# Altium schematic sheet seeds.SchDoc
size A4
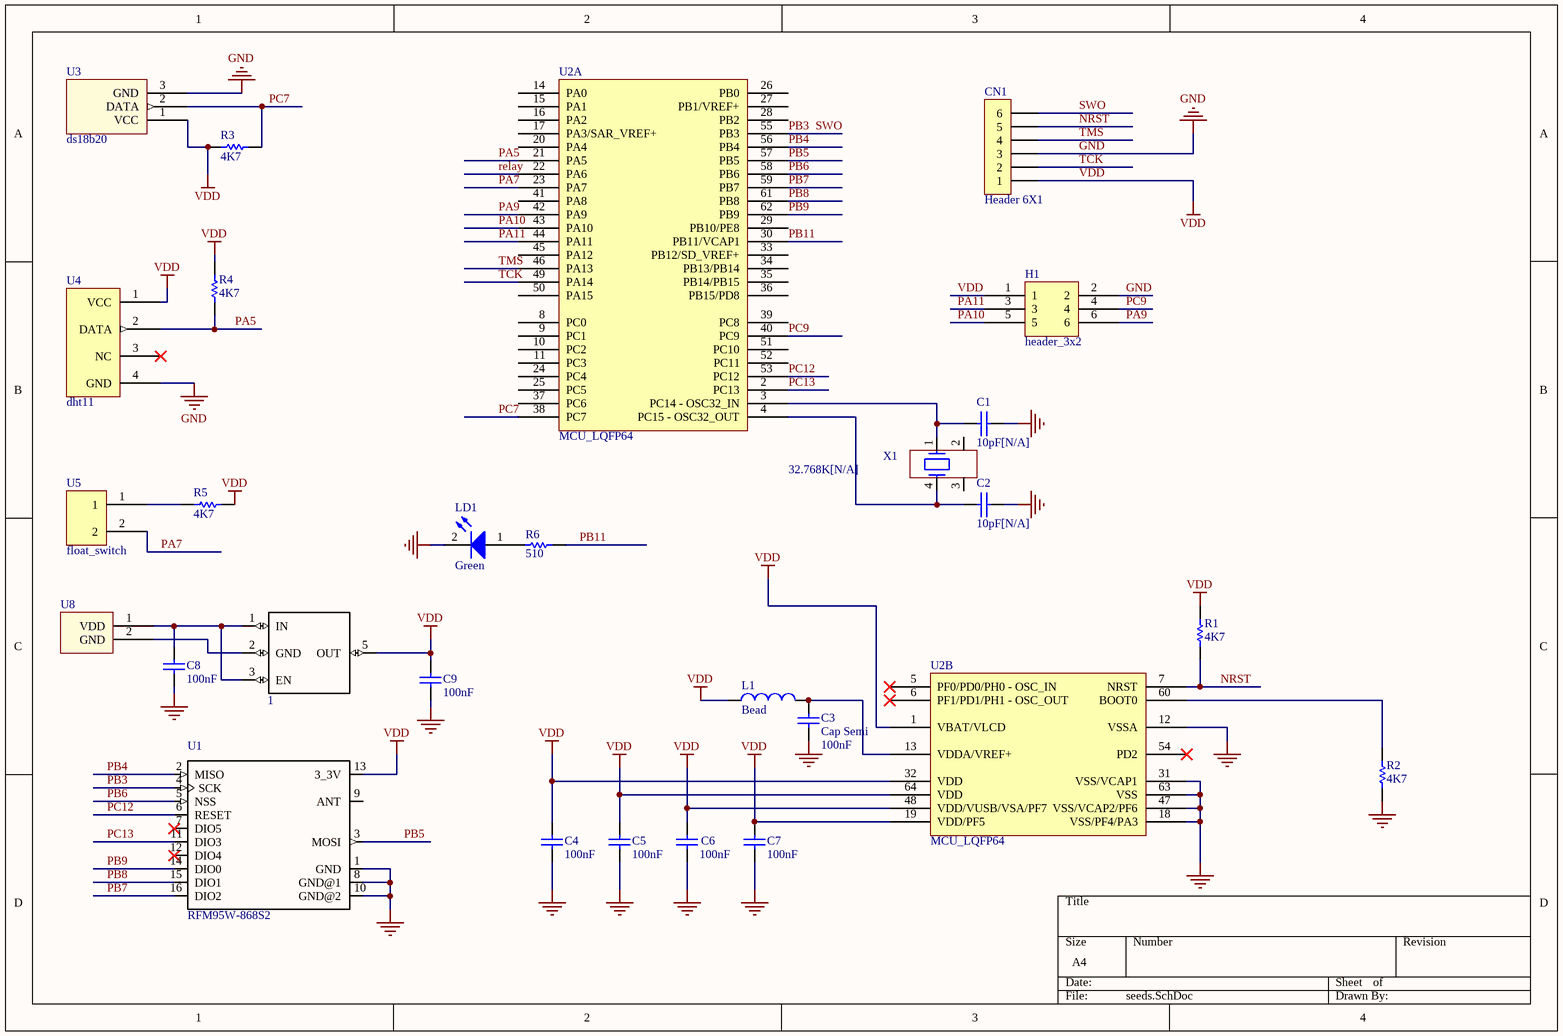
[diagram p0: seeds.SchDoc]

## Parts
1  TLV70233DBVR  [SOT23-5]  (value not drawn)
C1  10pF[N/A]  [0603C]
C2  10pF[N/A]  [0603C]
C3  Cap Semi  value 100nF  [1608[0603]]
C4  100nF  [0603C]
C5  100nF  [0603C]
C6  100nF  [0603C]
C7  100nF  [0603C]
C8  100nF  [0603C]
C9  100nF  [0603C]
CN1  Header 6X1  [1*6P]
H1  header_3x2  [header_3x2]
L1  Bead  [INDC1608L]
LD1  Green  [0603D]
R1  4K7  [0603R]
R2  4K7  [0603R]
R3  4K7  [0603R]
R4  4K7  [0603R]
R5  4K7  [0603R]
R6  510  [0603R]
U1  RFM95W-868S2  [XCVR_RFM95W-868S2]
U2  MCU_LQFP64  [LQFP64]  (parts A,B of 2)
U3  ds18b20  [ds18b20]
U4  dht11  [dht11]
U5  float_switch  [float_switch]
U8  BATTERY_CONNECTOR  [BATTERY_CONNECTOR]  (value not drawn)
X1  32.768K[N/A]  [XTAL_4SM_8X3R8]

## Nets
GND: C1.2 C2.2 C3.2 C4.2 C5.2 C6.2 C7.2 C8.2 C9.2 CN1.3 H1.2 LD1.2(K) R2.1 U1.1(GND) U1.8(GND@1) U1.10(GND@2) U2.12(VSSA) U2.18(VSS/PF4/PA3) U2.31(VSS/VCAP1) U2.47(VSS/VCAP2/PF6) U2.63(VSS) U3.3(GND) U4.4(GND)
VDD: 1.5(OUT) C4.1 C5.1 C6.1 C7.1 C9.1 CN1.1 H1.1 L1.1 R1.2 R3.2 R4.1 R5.1 U1.13(3_3V) U2.1(VBAT/VLCD) U2.19(VDD/PF5) U2.32(VDD) U2.48(VDD/VUSB/VSA/PF7) U2.64(VDD) U3.1(VCC) U4.1(VCC)
NRST: CN1.5 R1.1 U2.7(NRST)
PA5: R4.2 U2.21(PA5) U4.2(DATA)
PA7: U2.23(PA7) U5.2
PA9: H1.6 U2.42(PA9)
PA10: H1.5 U2.43(PA10)
PA11: H1.3 U2.44(PA11)
PB3: CN1.6 U1.4(SCK) U2.55(PB3)  [also labelled SWO]
PB4: U1.2(MISO) U2.56(PB4)
PB5: U1.3(MOSI) U2.57(PB5)
PB6: U1.5(NSS) U2.58(PB6)
PB7: U1.16(DIO2) U2.59(PB7)
PB8: U1.15(DIO1) U2.61(PB8)
PB9: U1.14(DIO0) U2.62(PB9)
PB11: R6.1 U2.30(PB11/VCAP1)
PC7: R3.1 U2.38(PC7) U3.2(DATA)
PC9: H1.4 U2.40(PC9)
PC12: U1.6(RESET) U2.53(PC12)
PC13: U1.11(DIO3) U2.2(PC13)
relay: U2.22(PA6)
TCK: CN1.2 U2.49(PA14)
TMS: CN1.4 U2.46(PA13)
Net1_1: 1.1(IN) 1.3(EN) C8.1 U8.1(VDD)
Net1_2: 1.2(GND) U8.2(GND)
NetC1_1: C1.1 U2.3(PC14_-_OSC32_IN) X1.1
NetC2_1: C2.1 U2.4(PC15_-_OSC32_OUT) X1.4
NetC3_1: C3.1 L1.2 U2.13(VDDA/VREF+)
NetLD1_1: LD1.1(A) R6.2
NetR2_2: R2.2 U2.60(BOOT0)
NetR5_2: R5.2 U5.1

Not connected (* = marked no-connect by the designer): U1 7(DIO5)* 9(ANT) 12(DIO4)*; U2 5(PF0/PD0/PH0_-_OSC_IN)* 6(PF1/PD1/PH1_-_OSC_OUT)* 8(PC0) 9(PC1) 10(PC2) 11(PC3) 14(PA0) 15(PA1) 16(PA2) 17(PA3/SAR_VREF+) 20(PA4) 24(PC4) 25(PC5) 26(PB0) 27(PB1/VREF+) 28(PB2) 29(PB10/PE8) 33(PB12/SD_VREF+) 34(PB13/PB14) 35(PB14/PB15) 36(PB15/PD8) 37(PC6) 39(PC8) 41(PA8) 45(PA12) 50(PA15) 51(PC10) 52(PC11) 54(PD2)*; U4 3(NC)*; X1 2 3

## Library data of the parts
1 = TLV70233DBVR: LDO voltage regulator [Texas Instruments] TLV70233DBVR LDO voltage regulator; MP: TLV70233DBVR; Package: None; MF: Texas Instruments; Price: 0.25 USD; Availability: Good; Value: *
C1 = Cap: Capacitor
C2 = CAP: Capacitor
C3 = Cap Semi: Capacitor (Semiconductor SIM Model); Published: 8-Jun-2000; LatestRevisionDate: 29-May-2009; LatestRevisionNote: IPC-7351 Footprint Added.; PackageReference: C1206; Publisher: Altium Limited; PackageDescription: Chip Capacitor
C4-C9 = Cap: Capacitor; Value: 10nF; Published: 8-Jun-2000; Revision: July-2002: Re-released for DXP Platform.; Publisher: Altium Limited
CN1 = Header 6X1: Header, 6-Pin, Single row; LatestRevisionDate: 17-Jul-2002; LatestRevisionNote: Re-released for DXP Platform.; Publisher: Altium Limited
L1 = Inductor: Code_IEC: 1005; Value: 10mH; Published: 8-Jun-2000; LatestRevisionDate: 29-May-2009; LatestRevisionNote: IPC-7351 Footprint Added.; PackageReference: 0402-A; Publisher: Altium Limited; PackageDescription: Chip Inductor; Code_JEITA: 0402
LD1 = LED2: Typical RED, GREEN, YELLOW, AMBER GaAs LED; Published: 8-Jun-2000; Revision: July-2002: Re-released for DXP Platform.; Publisher: Altium Limited
R1-R6 = Res1: Resistor; Value: 1K; Published: 8-Jun-2000; Publisher: Altium Limited; Revision: July-2002: Re-released for DXP Platform.
U1 = RFM95W-868S2: MF: Hope Microelectronics; MP: RFM95W-868S2; Availability: Warning; Price: 8.44 USD; Package: SMD-16 Hope Microelectronics; Value: *
X1 = MC306